# EAGLE schematic hub (EAGLE 7.1.0)
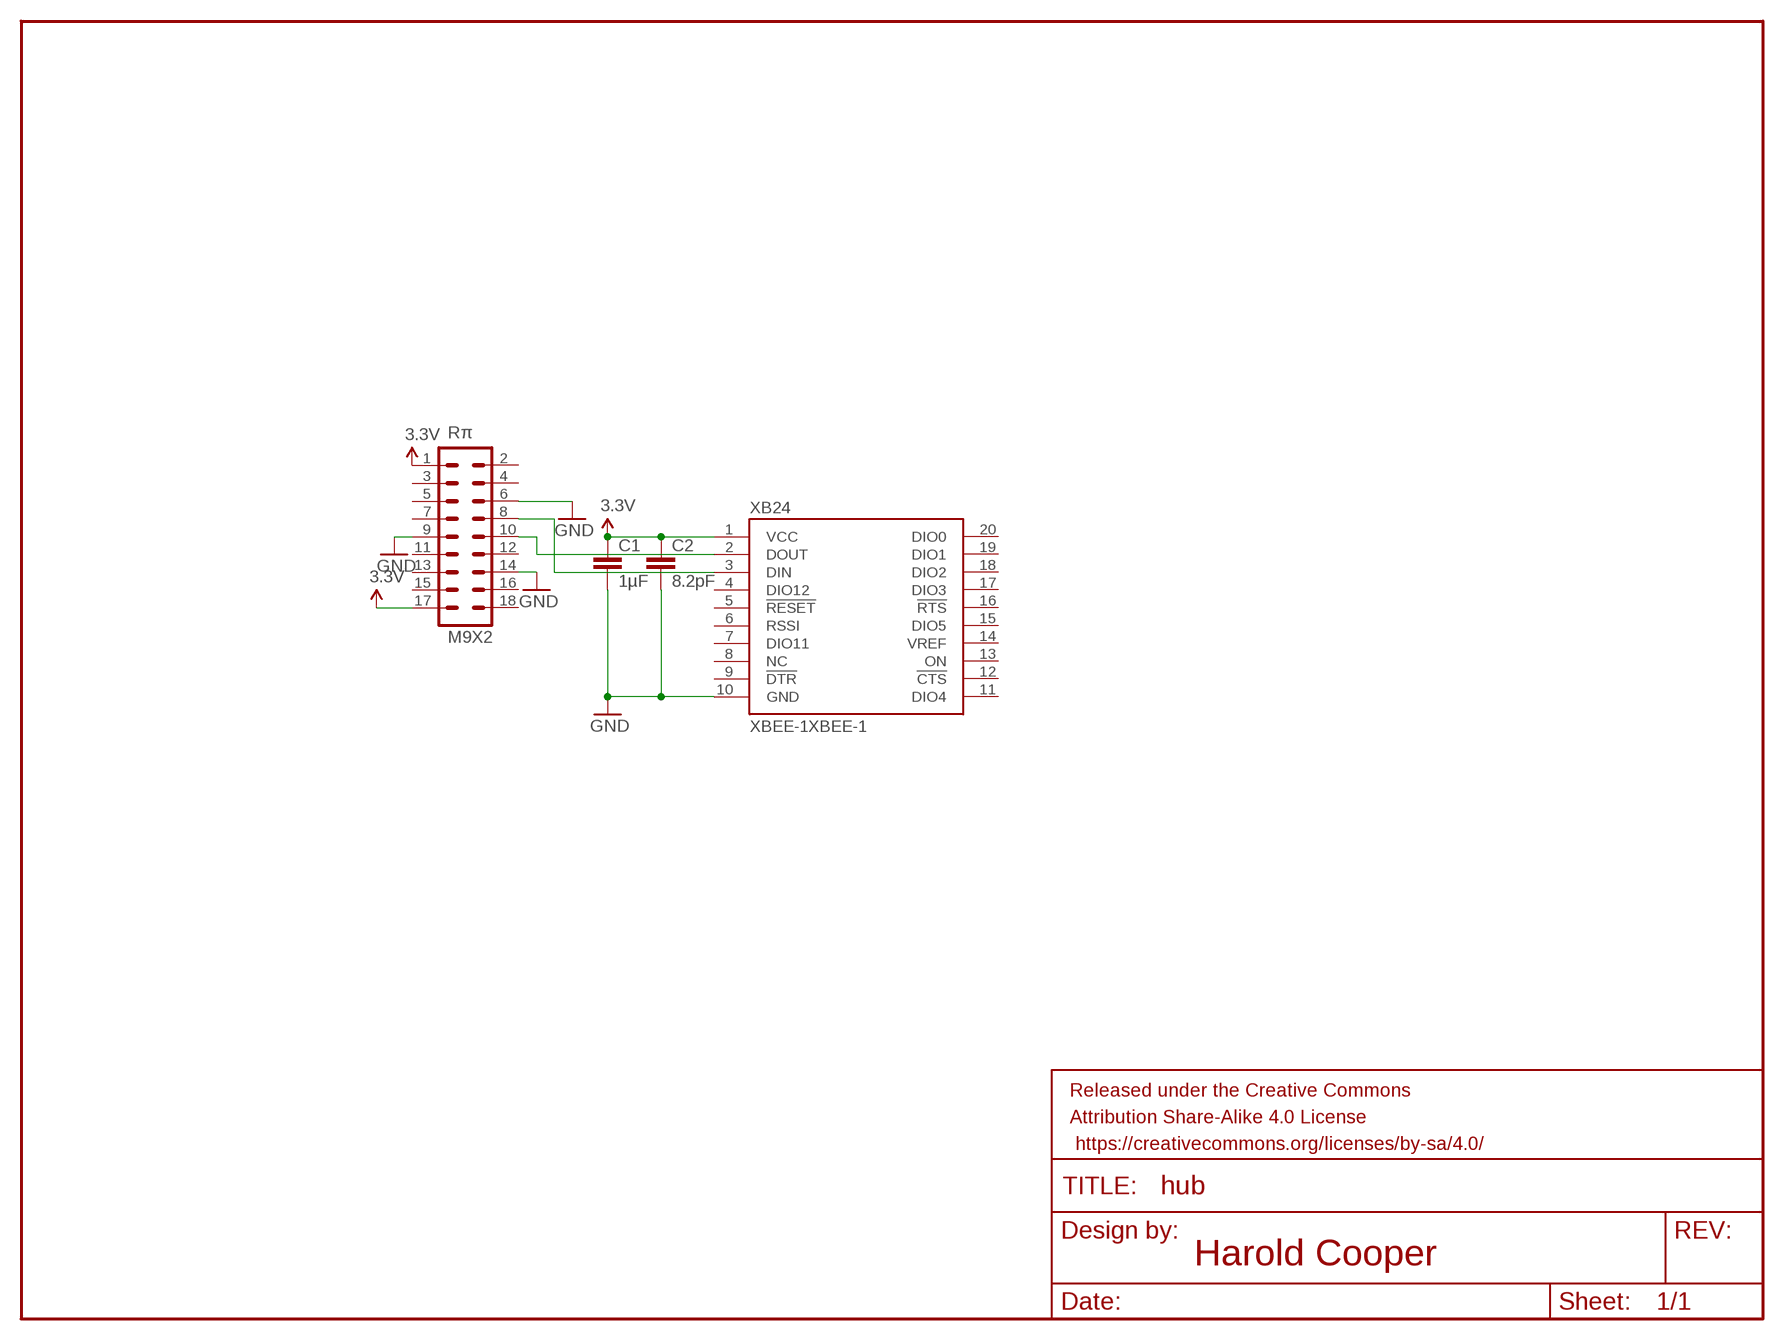
[diagram p0: schematic, sheet 1]

## Parts
C1  1µF  CAP0805  [0805]
C2  8.2pF  CAP0805  [0805]
FRAME1  FRAME-LETTER  [CREATIVE_COMMONS]
Rπ  M9X2  [2X9_NOSILK]
XB24  XBEE-1XBEE-1  [XBEE-1]

## Nets
3.3V: C1.1 C2.1 Rπ.1 Rπ.17 XB24.1(VCC)
GND: C1.2 C2.2 Rπ.6 Rπ.9 Rπ.14 XB24.10(GND)
N$1: Rπ.10 XB24.2(DOUT)
N$2: Rπ.8 XB24.3(DIN)
Unconnected: Rπ.2 Rπ.3 Rπ.4 Rπ.5 Rπ.7 Rπ.11 Rπ.12 Rπ.13 Rπ.15 Rπ.16 Rπ.18 XB24.4(DIO12) XB24.5(!RESET) XB24.6(RSSI) XB24.7(DIO11) XB24.8(NC) XB24.9(!DTR) XB24.11(DIO4) XB24.12(!CTS) XB24.13(ON) XB24.15(DIO5) XB24.16(!RTS) XB24.17(DIO3) XB24.18(DIO2) XB24.19(DIO1) XB24.20(DIO0)

## Notes on the sheet
- Harold Cooper

## Power pins joined to a net without a drawn wire
VREF: XB24.14(VREF)

## Library data of the parts
C1 C2 = SparkFun-Capacitors:CAP: Capacitor Standard 0603 ceramic capacitor, and 0.1" leaded capacitor.
FRAME1 = SparkFun-Aesthetics:FRAME-LETTER: Schematic Frame Standard 8.5x11 US Letter frame
Rπ = hrldcpr:M9X2
XB24 = hrldcpr:XBEE-1: Xbee module footprints SMT header is CONN-09042.